# Altium schematic sheet AT86RF231.SchDoc
size A4
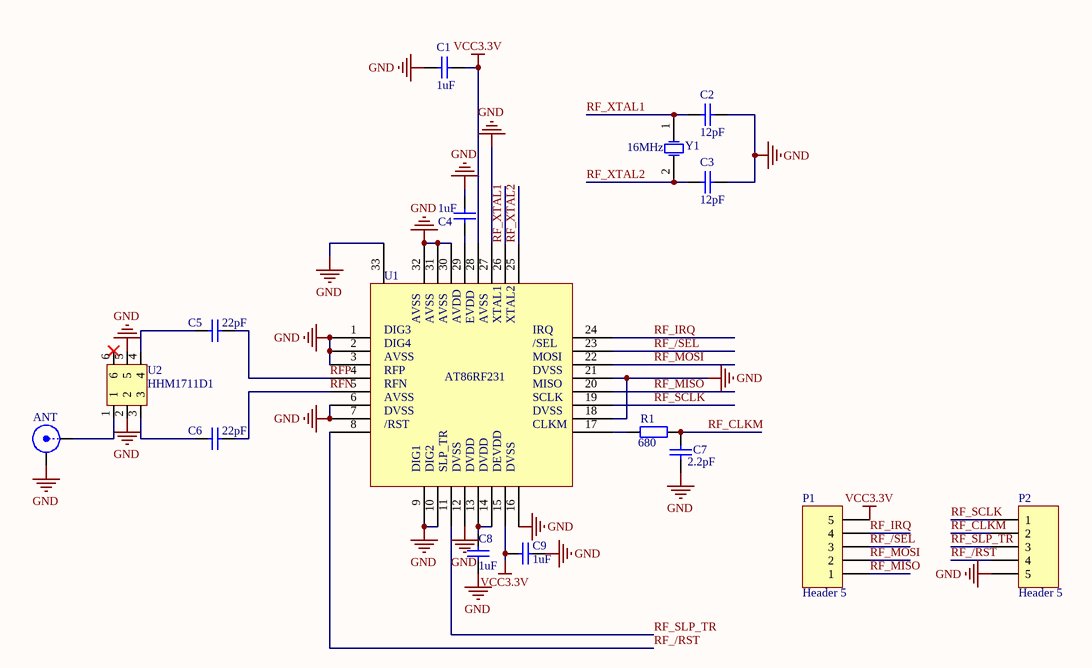
[diagram p0: AT86RF231.SchDoc]

## Parts
ANT  SMA  [ANT]  (value not drawn)
C1  1uF  [0402]
C2  12pF  [0402]
C3  12pF  [0402]
C4  1uF  [0402]
C5  22pF  [0402]
C6  22pF  [0402]
C7  2.2pF  [0402]
C8  1uF  [0402]
C9  1uF  [0402]
P1  Header 5  [HDR1X5]
P2  Header 5  [HDR1X5]
R1  680  [0402]
U1  AT86RF231  [AT86]
U2  HHM1711D1  [HHM1711D1]
Y1  value 16MHz  [XTAL_5032_SMD]  (hidden comment: XTAL)

## Nets
GND: ANT.2(Y) C1.1 C2.1 C3.1 C4.1 C7.1 C8.1 C9.1 P2.5 U1.1 U1.2 U1.3 U1.6 U1.7 U1.9 U1.10 U1.12 U1.16 U1.18 U1.21 U1.27 U1.30 U1.31 U1.32 U1.33 U2.2 U2.5
VCC3.3V: C1.2 C9.2 P1.5 U1.15 U1.28
RF_/RST: P2.4 U1.8
RF_/SEL: P1.3 U1.23
RF_CLKM: C7.2 P2.2 R1.2
RF_IRQ: P1.4 U1.24
RF_MISO: P1.1 U1.20
RF_MOSI: P1.2 U1.22
RF_SCLK: P2.1 U1.19
RF_SLP_TR: P2.3 U1.11
RF_XTAL1: C2.2 U1.26 Y1.1(OSC1)
RF_XTAL2: C3.2 U1.25 Y1.2(OSC2)
RFN: C6.2 U1.5
RFP: C5.2 U1.4
NetANT_1: ANT.1(X) U2.1
NetC4_2: C4.2 U1.29
NetC5_1: C5.1 U2.4
NetC6_1: C6.1 U2.3
NetC8_2: C8.2 U1.13 U1.14
NetR1_1: R1.1 U1.17

Not connected (* = marked no-connect by the designer): U2 6*

## Notes on the sheet
- (in symbol AT86RF231) AVSS; AVDD; EVDD; XTAL1; XTAL2; DIG3; IRQ; DIG4; /SEL; MOSI; RFP; DVSS; RFN; MISO; SCLK; /RST; CLKM; DIG1; DIG2; SLP_TR; DVDD; DEVDD

## Library data of the parts
ANT = SMB: SMB Straight Connector; LatestRevisionDate: 17-Jul-2002; LatestRevisionNote: Re-released for DXP Platform.; Publisher: Altium Limited
C1-C9 = Cap: Capacitor; Published: 8-Jun-2000; LatestRevisionDate: 17-Jul-2002; LatestRevisionNote: Re-released for DXP Platform.; PackageReference: RAD-0.3; Publisher: Altium Limited; PackageDescription: Radial Cap, Thru-Hole; 2 Leads; 0.3 in Pin Spacing
  C1 C4 C8 C9: Value: 1uF
  C2 C3: Value: 12pF
  C5 C6: Value: 22pF
  C7: Value: 2.2pF
P1 P2 = Header 5: Header, 5-Pin; LatestRevisionDate: 17-Jul-2002; LatestRevisionNote: Re-released for DXP Platform.; Publisher: Altium Limited
R1 = Res2: Resistor; Published: 8-Jun-2000; LatestRevisionDate: 17-Jul-2002; LatestRevisionNote: Re-released for DXP Platform.; PackageReference: AXIAL-0.4; Publisher: Altium Limited; PackageDescription: Axial Device, Thru-Hole; 2 Leads; 0.4 in Pin Spacing; Value: 680
U2 = HHM1711D1: HHM1711D1 For Bluetooth & IEEE802.11b/g
Y1 = XTAL: Crystal Oscillator; Published: 8-Jun-2000; LatestRevisionDate: 17-Jul-2002; LatestRevisionNote: Re-released for DXP Platform.; PackageReference: R38; Publisher: Altium Limited; PackageDescription: Crystal, Thru-Hole; 2 Leads; Body 3.1 x 8.2 mm (Dia.xH)
U1 = AT86RF231: Value: AT86RF231